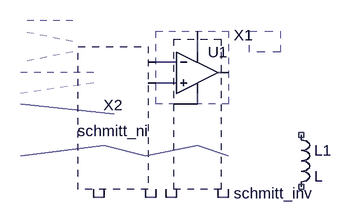
[diagram p0: schematic Draft2.asc]
Draft2.asc, the LTspice schematic file:
Version 4
SHEET 1 880 680
WIRE 272 144 272 112
WIRE 240 160 208 160
WIRE 320 176 304 176
WIRE 240 192 208 192
WIRE 272 224 272 208
WIRE 128 368 112 368
WIRE 208 368 192 368
WIRE 240 368 224 368
WIRE 320 368 304 368
SYMBOL Opamps\\UniversalOpamp2 272 176 R0
SYMATTR InstName U1
SYMBOL circuiTikz\\blockdiagram\\schmitt_inv 272 368 R0
SYMATTR InstName X1
SYMBOL circuiTikz\\blockdiagram\\schmitt_ni 160 368 R0
SYMATTR InstName X2
SYMBOL ind 416 256 R0
SYMATTR InstName L1
LINE Normal 80 96 0 96 2
LINE Normal 80 128 0 112 1
LINE Normal 80 144 0 160 2
LINE Normal 112 176 0 176 3
LINE Normal 112 192 0 208 4
LINE Normal 144 240 0 224
LINE Normal 128 288 0 304
LINE Normal 192 304 128 288
LINE Normal 272 288 192 304
LINE Normal 320 304 272 288
RECTANGLE Normal 320 224 208 112 2
RECTANGLE Normal 400 144 352 112 1

The netlist it stands for:
* Draft2.asc
XU1 N004 N002 N001 N005 N003 level.2 Avol=1Meg GBW=10Meg Slew=10Meg ilimit=25m rail=0 Vos=0 phimargin=45 en=0 enk=0 in=0 ink=0 Rin=500Meg  ; pins IN+ IN- V+ V- OUT
* X1: schmitt_inv (symbol circuiTikz\blockdiagram\schmitt_inv not available, pin order unknown); nets seen at it: N001, N003, N005, N008, N009
* X2: schmitt_ni (symbol circuiTikz\blockdiagram\schmitt_ni not available, pin order unknown); nets seen at it: N002, N004, N006, N007
L1 NC_01 NC_02 L
.lib UniversalOpamps2.sub
.backanno
.end